# Altium schematic sheet BlackChat China Rx.SchDoc
size Letter
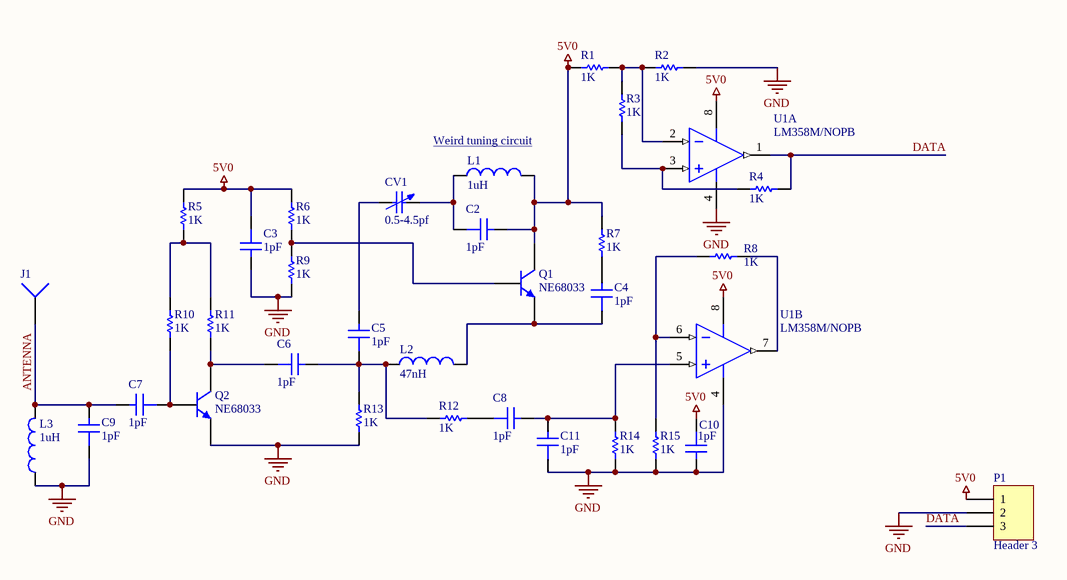
[diagram p0: BlackChat China Rx.SchDoc]

## Parts
C2  1pF  [CAP-0805]
C3  1pF  [CAP-0805]
C4  1pF  [CAP-0805]
C5  1pF  [CAP-0805]
C6  1pF  [CAP-0805]
C7  1pF  [CAP-0805]
C8  1pF  [CAP-0805]
C9  1pF  [CAP-0805]
C10  1pF  [CAP-0805]
C11  1pF  [CAP-0805]
CV1  0.5-4.5pf  [CAP-GSX364]
J1  Socket  [PIN1]  (value not drawn)
L1  1uH  [C1210]
L2  47nH  [C1210]
L3  1uH  [AXIAL-0.3]
P1  Header 3  [HDR1X3]
Q1  NE68033  [SOT95P275X120-3N]
Q2  NE68033  [SOT95P275X120-3N]
R1  1K  [RES-0805]
R2  1K  [RES-0805]
R3  1K  [RES-0805]
R4  1K  [RES-0805]
R5  1K  [RES-0805]
R6  1K  [RES-0805]
R7  1K  [RES-0805]
R8  1K  [RES-0805]
R9  1K  [RES-0805]
R10  1K  [RES-0805]
R11  1K  [RES-0805]
R12  1K  [RES-0805]
R13  1K  [RES-0805]
R14  1K  [RES-0805]
R15  1K  [RES-0805]
U1  LM358M/NOPB  [M08A_L]  (parts A,B of 2)

## Nets
5V0: C2.2 C3.1 C10.1 L1.2 P1.1 Q1.3(C) R1.2 R5.2 R6.2 R7.1 U1.8(V+)
GND: C3.2 C9.1 C10.2 C11.1 L3.1 P1.2 Q2.1(E) R2.1 R9.1 R13.1 R14.2 R15.2 U1.4(GND)
ANTENNA: C7.2 C9.2 J1.1 L3.2
DATA: P1.3 R4.2 U1.1(OUTA)
NetC2_1: C2.1 CV1.2 L1.1
NetC4_1: C4.1 L2.2 Q1.1(E)
NetC4_2: C4.2 R7.2
NetC5_1: C5.1 C6.2 L2.1 R12.2 R13.2
NetC5_2: C5.2 CV1.1
NetC6_1: C6.1 Q2.3(C) R11.1
NetC7_1: C7.1 Q2.2(B) R10.1
NetC8_1: C8.1 R12.1
NetC8_2: C8.2 C11.2 R14.1 U1.5(INB+)
NetQ1_2: Q1.2(B) R6.1 R9.2
NetR1_1: R1.1 R2.2 R3.1 U1.2(INA-)
NetR3_2: R3.2 R4.1 U1.3(INA+)
NetR5_1: R5.1 R10.2 R11.2
NetR8_1: R8.1 R15.1 U1.6(INB-)
NetR8_2: R8.2 U1.7(OUTB)

## Notes on the sheet
- (near L1) Weird tuning circuit

## Library data of the parts
C2-C11 = CHIP-CAP: SMD Chip Capacitor; Value: 1pF
CV1 = GSX364: 0.5pF to 4.5pF variable capacitor.; Value: 0.5-4.5pf
L1-L3 = Inductor: Generic Inductor
  L1 L3: Value: 1uH
  L2: Value: 47nH
P1 = Header 3: Header, 3-Pin; LatestRevisionDate: 17-Jul-2002; LatestRevisionNote: Re-released for DXP Platform.; Publisher: Altium Limited
Q1 Q2 = NE68033: NPN SILICON HIGH FREQUENCY TRANSISTOR
R1-R15 = CHIP-RES: SMD Chip Resistor; Value: 1K
U1 = CMP-0055-00634-2: Low Power Dual Operational Amplifier, 8-pin Narrow SOIC, Pb-Free; Manufacturer: National Semiconductor; PowerWise: N; PackageTopMarking: NSZXTT*LM*358M; CompType: Amplifiers; ComponentLink3Description: M08A Package Page; PackageReference: M08A; ComponentLink2Description: LM358 Web Page; RoHS: Y; Code_JEDEC: MS-012-AA; ComponentLink3URL: http://www.national.com/packaging/folders/m08a.html; DatasheetVersion: Oct-2005; RevisionNote: Component URLs added; PinCount: 8; ComponentLink1URL: http://www.national.com/ds/LM/LM358.pdf; PackageDescription: SOIC Narrow, 4.9 x 3.9 x 1.45mm, 8 Lead, 1.27mm Pitch; ComponentLink2URL: http://www.national.com/pf/LM/LM358.html; ComponentLink1Description: LM358 Datasheet; Code_IPC: SOIC127P600-8; PackageVersion: revM, May-2009
J1 = Socket: LatestRevisionDate: 17-Jul-2002; LatestRevisionNote: Re-released for DXP Platform.; Publisher: Altium Limited